# EAGLE design brd (EAGLE 6.5.0)
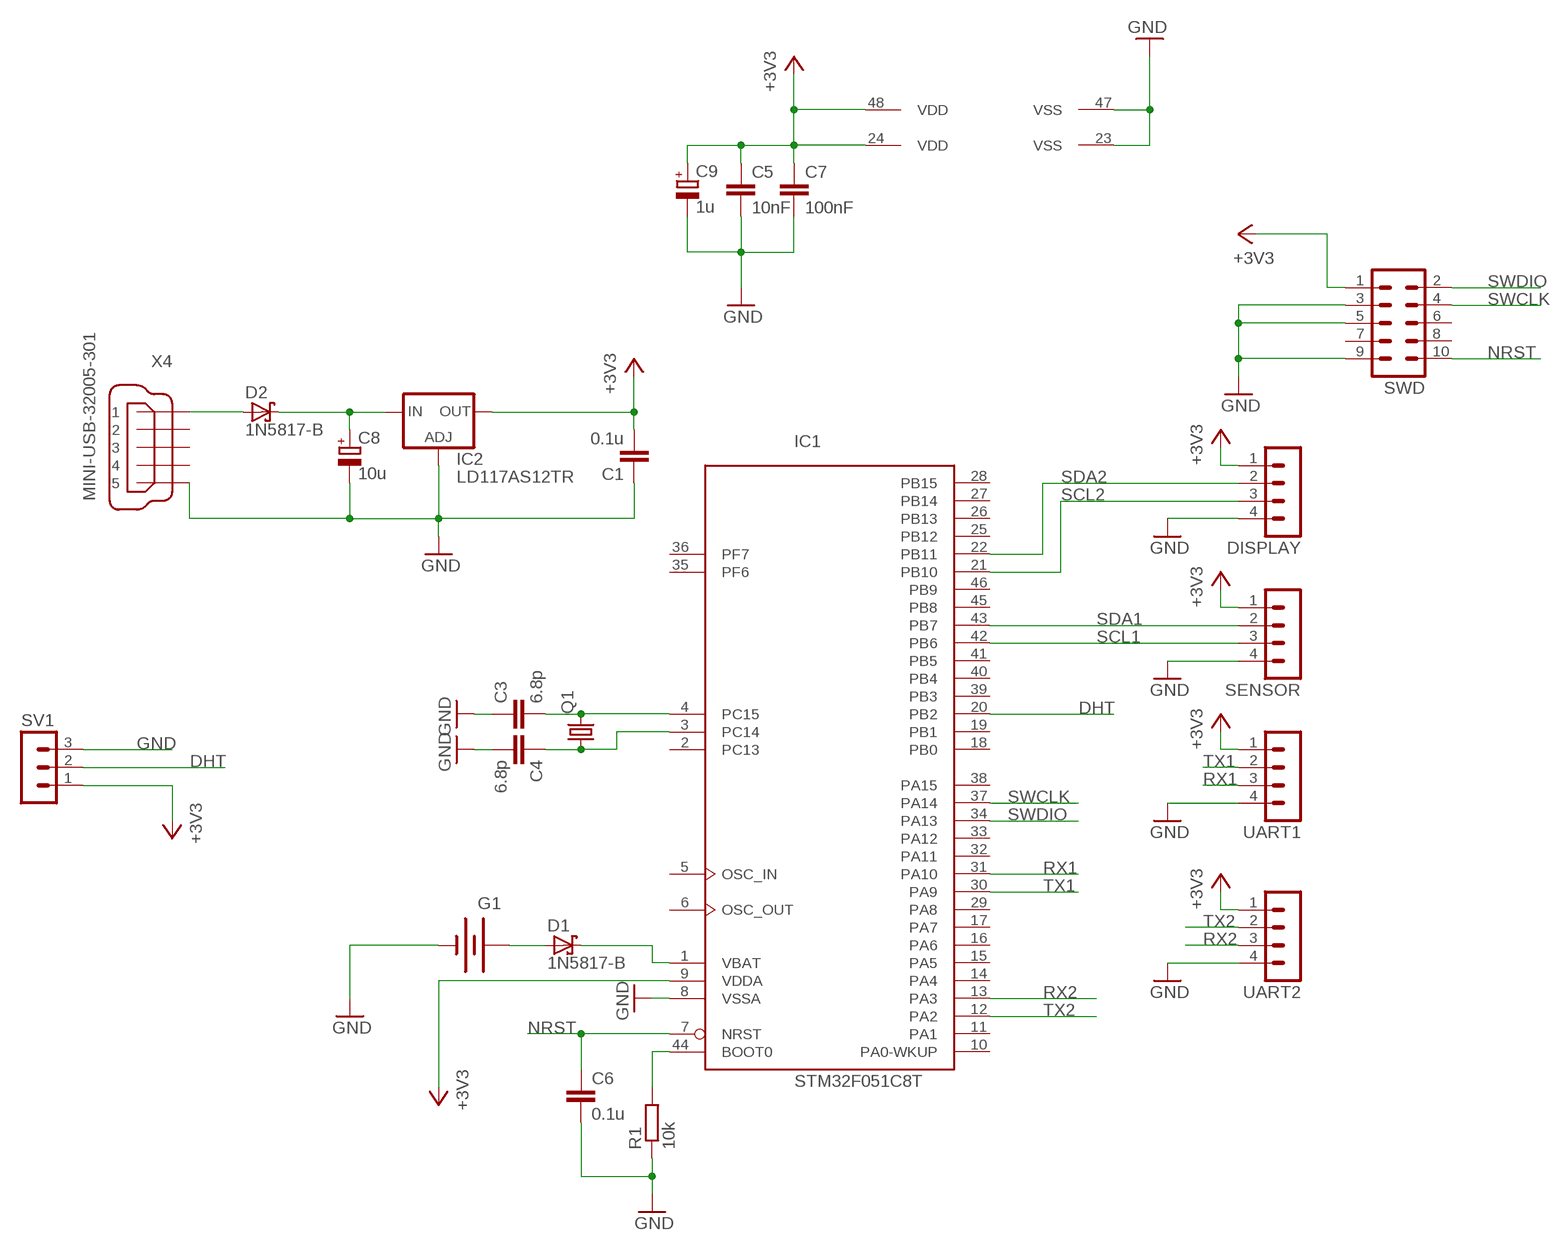
[diagram p0: schematic, sheet 1]

## Parts
C1  0.1u  C-EU025-024X044  [C025-024X044]
C3  6.8p  C-EUC0805  [C0805]
C4  6.8p  C-EUC0805  [C0805]
C5  10nF  C-EUC0805  [C0805]
C6  0.1u  C-EUC0805  [C0805]
C7  100nF  C-EUC0805  [C0805]
C8  10u  CPOL-EUE2,5-6E  [E2,5-6E]
C9  1u  CPOL-EUE2,5-6E  [E2,5-6E]
D1  1N5817-B  [DO41-7.6]
D2  1N5817-B  [DO41-7.6]
DISPLAY  MA04-1  [MA04-1]
G1  BATTERY20PTH  [BATTCOM_20MM_PTH]
IC1  STM32F051C8T  [LQFP48]
IC2  LD117AS12TR  [SOT223]
Q1  CRYSTALTC26H  [TC26H]
R1  10k  R-EU_R0805  [R0805]
SENSOR  MA04-1  [MA04-1]
SV1  MA03-1  [MA03-1]
SWD  MA05-2  [MA05-2]
UART1  MA04-1  [MA04-1]
UART2  MA04-1  [MA04-1]
X4  MINI-USB-32005-301  [32005-301]

## Nets
+3V3: C1.2 C5.1 C7.1 C9.+ DISPLAY.1 IC1.9(VDDA) IC1.24(VDD) IC1.48(VDD) IC2.4(OUT) SENSOR.1 SV1.1 SWD.1 UART1.1 UART2.1
DHT: IC1.20(PB2) SV1.2
GND: C1.1 C3.1 C4.2 C5.2 C6.2 C7.2 C8.- C9.- DISPLAY.4 G1.2(-) IC1.8(VSSA) IC1.23(VSS) IC1.47(VSS) IC2.1(ADJ) R1.1 SENSOR.4 SV1.3 SWD.3 SWD.5 SWD.9 UART1.4 UART2.4 X4.5
N$1: C8.+ D2.C IC2.3(IN)
N$2: C3.2 IC1.4(PC15) Q1.2
N$3: IC1.44(BOOT0) R1.2
N$4: C4.1 IC1.3(PC14) Q1.1
N$6: D2.A X4.1
N$7: D1.C IC1.1(VBAT)
N$8: D1.A G1.1(+)
NRST: C6.1 IC1.7(NRST) SWD.10
RX1: IC1.31(PA10) UART1.3
RX2: IC1.13(PA3) UART2.3
SCL1: IC1.42(PB6) SENSOR.3
SCL2: DISPLAY.3 IC1.21(PB10)
SDA1: IC1.43(PB7) SENSOR.2
SDA2: DISPLAY.2 IC1.22(PB11)
SWCLK: IC1.37(PA14) SWD.4
SWDIO: IC1.34(PA13) SWD.2
TX1: IC1.30(PA9) UART1.2
TX2: IC1.12(PA2) UART2.2
Unconnected: IC1.2(PC13) IC1.5(OSC_IN) IC1.6(OSC_OUT) IC1.10(PA0-WKUP) IC1.11(PA1) IC1.14(PA4) IC1.15(PA5) IC1.16(PA6) IC1.17(PA7) IC1.18(PB0) IC1.19(PB1) IC1.25(PB12) IC1.26(PB13) IC1.27(PB14) IC1.28(PB15) IC1.29(PA8) IC1.32(PA11) IC1.33(PA12) IC1.35(PF6) IC1.36(PF7) IC1.38(PA15) IC1.39(PB3) IC1.40(PB4) IC1.41(PB5) IC1.45(PB8) IC1.46(PB9) SWD.6 SWD.7 SWD.8 X4.2 X4.3 X4.4

## Library data of the parts
C1 C3-C7 = rcl:C-EU: CAPACITOR, European symbol
C8 C9 = rcl:CPOL-EU: POLARIZED CAPACITOR, European symbol
D1 D2 = diode:1N581*: 1.0A SCHOTTKY BARRIER RECTIFIER Source: http://www.diodes.com/datasheets/ds23001.pdf
DISPLAY SENSOR UART1 UART2 = con-lstb:MA04-1: PIN HEADER; OC_FARNELL: unknown; OC_NEWARK: unknown
G1 = SparkFun-Electromechanical:BATTERY: Battery Holders Various common sizes : AA, AAA, 18650 (PRT-12895), 20mm coin cell and 12mm coin cell. 20MM_4LEGS, BATT-10373
IC1 = micro-stm_v2:STM32F051C*T: ARM 32-bit Cortex™-M0 CPU 48 MHz maximum frequency 16 to 64 Kbytes of Flash memory 4 to 8 kbytes of SRAM 39 GPIOs 2.0 to 3.6 V application supply
IC2 = v-reg:LD117A?*: Low drop fixed and adjustable positive voltage regulators 1 A Source: http://www.st.com/stonline/products/literature/ds/7194/ld1117axx.pdf
Q1 = crystal:CRYSTAL: CRYSTAL; OC_FARNELL: unknown; OC_NEWARK: unknown
R1 = rcl:R-EU_: RESISTOR, European symbol
SV1 = con-lstb:MA03-1: PIN HEADER; OC_FARNELL: unknown; OC_NEWARK: unknown
SWD = con-lstb:MA05-2: PIN HEADER; OC_FARNELL: unknown; OC_NEWARK: unknown
X4 = con-cypressindustries:MINI-USB-: MINI USB-B Conector Source: www.cypressindustries.com; OC_FARNELL: unknown; OC_NEWARK: unknown

## Board
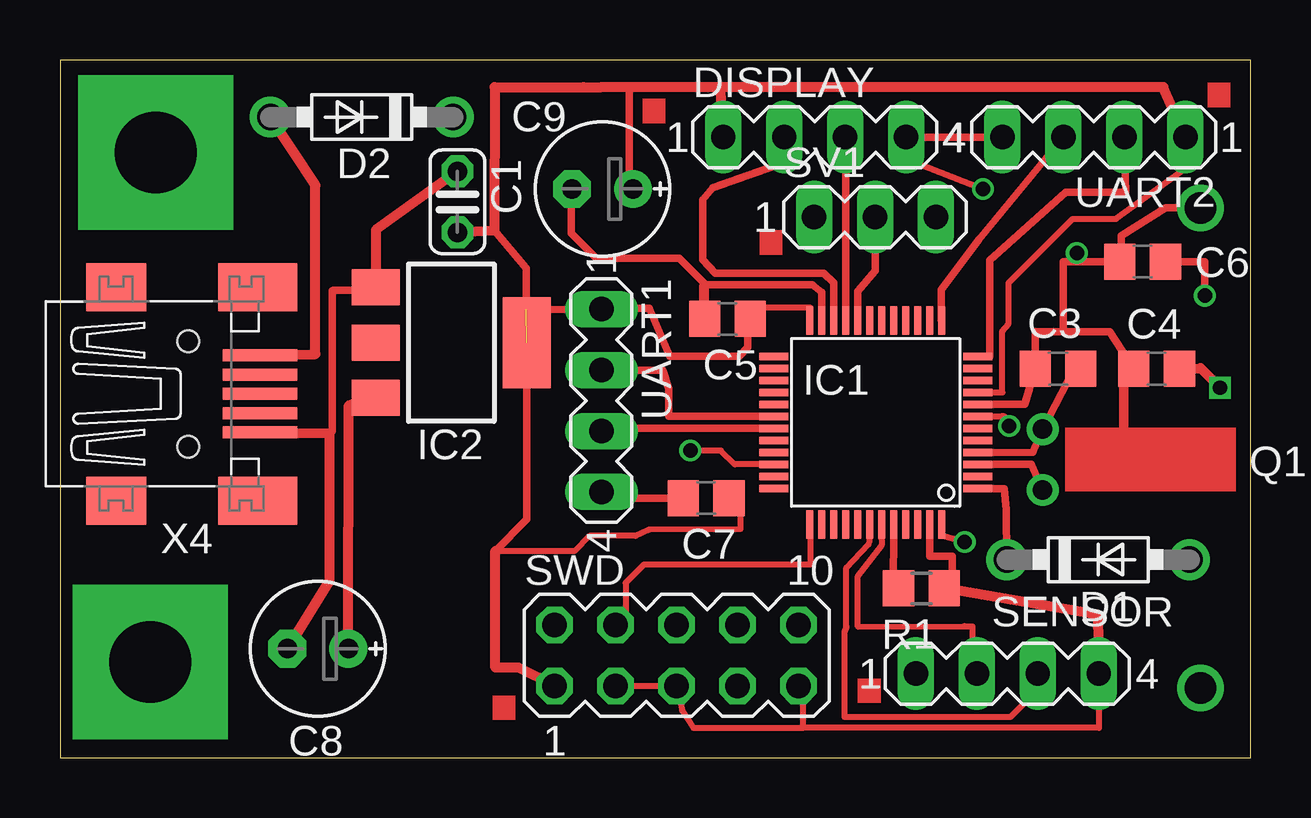
[diagram p1: board, top side]
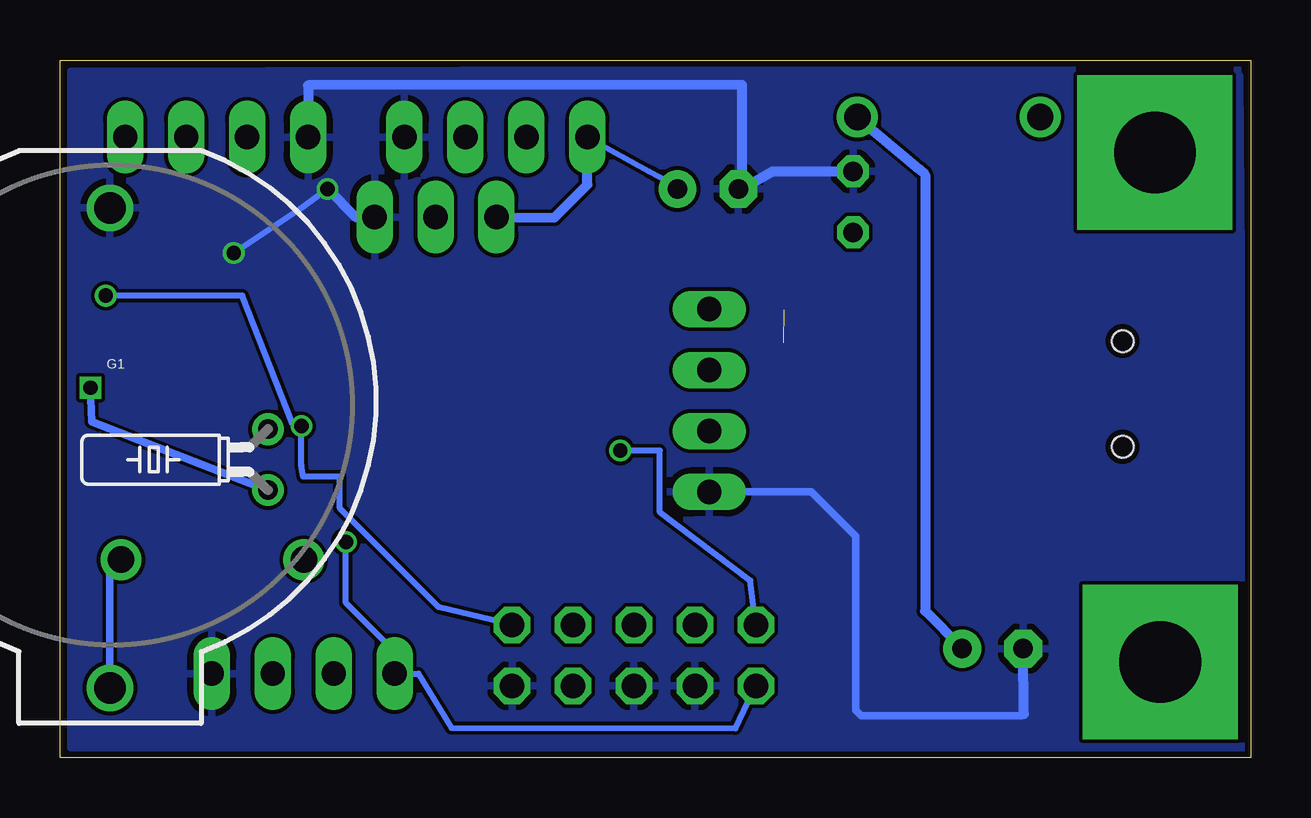
[diagram p2: board, bottom side, seen from below]

Size 49.61 x 29.07 mm. Coordinates in mm from the lower left corner, seen from the top.
Outline: 0,0 49.61,0 49.61,29.07 0,29.07 0,0
Copper layers (1*16): Top 0.035mm / dielectric 1.5mm / Bottom 0.035mm
Design rules "SeeedStudio_2layer_DRU_no_angle_20140221": minimum track width 6mil, minimum drill 12mil, track to track 6mil, track to pad 6mil, pad to pad 6mil, via to via 6mil, smd to smd 0mil, copper to edge 10mil, drill to drill 10mil, minimum pad ring 10mil, minimum via ring 6mil, stop-mask expansion 2mil, vias tented up to drill 100mil, thermal gap 10mil

### Footprints (pad centres in the part's own frame; a part is rotated, then mirrored left to right if it is on the bottom)
C025-024X044 = drill 0.813 octagon: 1 -1.27,0; 2 1.27,0
C0805 = smd 1.3 x 1.5: 1 -0.95,0; 2 0.95,0
E2,5-6E = drill 0.813 pad 1.575: + -1.27,0 | drill 0.813 pad 1.575 octagon: - 1.27,0
DO41-7.6 = drill 1.1 pad 1.7: A 3.81,0; C -3.81,0
MA04-1 = drill 1.016 long: 1 -3.81,0; 2 -1.27,0; 3 1.27,0; 4 3.81,0
BATTCOM_20MM_PTH = drill 1.3: 1 11.85,0; 2 -8.15,0
LQFP48 = smd 0.3 x 1.2: 1 -2.75,-4.25; 2 -2.25,-4.25; 3 -1.75,-4.25; 4 -1.25,-4.25; 5 -0.75,-4.25; 6 -0.25,-4.25; 7 0.25,-4.25; 8 0.75,-4.25; 9 1.25,-4.25; 10 1.75,-4.25; 11 2.25,-4.25; 12 2.75,-4.25; 25 2.75,4.25; 26 2.25,4.25; 27 1.75,4.25; 28 1.25,4.25; 29 0.75,4.25; 30 0.25,4.25; 31 -0.25,4.25; 32 -0.75,4.25; 33 -1.25,4.25; 34 -1.75,4.25; 35 -2.25,4.25; 36 -2.75,4.25 | smd 1.2 x 0.3: 13 4.25,-2.75; 14 4.25,-2.25; 15 4.25,-1.75; 16 4.25,-1.25; 17 4.25,-0.75; 18 4.25,-0.25; 19 4.25,0.25; 20 4.25,0.75; 21 4.25,1.25; 22 4.25,1.75; 23 4.25,2.25; 24 4.25,2.75; 37 -4.25,2.75; 38 -4.25,2.25; 39 -4.25,1.75; 40 -4.25,1.25; 41 -4.25,0.75; 42 -4.25,0.25; 43 -4.25,-0.25; 44 -4.25,-0.75; 45 -4.25,-1.25; 46 -4.25,-1.75; 47 -4.25,-2.25; 48 -4.25,-2.75
SOT223 = smd 1.5 x 2: 1 -2.3,-3.15; 2 0,-3.15; 3 2.3,-3.15 | smd 3.8 x 2: 4 0,3.15
TC26H = drill 0.813: 1 -1.27,0; 2 1.27,0
R0805 = smd 1.3 x 1.5: 1 -0.95,0; 2 0.95,0
MA03-1 = drill 1.016 long: 1 -2.54,0; 2 0,0; 3 2.54,0
MA05-2 = drill 1.016 octagon: 1 -5.08,-1.27; 2 -5.08,1.27; 3 -2.54,-1.27; 4 -2.54,1.27; 5 0,-1.27; 6 0,1.27; 7 2.54,-1.27; 8 2.54,1.27; 9 5.08,-1.27; 10 5.08,1.27
32005-301 = smd 3.1 x 0.5: 1 3,1.6; 2 3,0.8; 3 3,0; 4 3,-0.8; 5 3,-1.6 | smd 2.5 x 2: M1 -3,-4.45; M2 -3,4.45 | smd 3.3 x 2: M3 2.9,4.45; M4 2.9,-4.45 | hole 0.9: 0,2.2; 0,-2.2

### Placement (x,y rotation side)
C1  16.56,23.16 270 top
C3  41.58,16.21 0 top
C4  45.69,16.21 180 top
C5  27.81,18.29 180 top
C6  45.11,20.68 180 top
C7  26.92,10.82 180 top
C8  10.74,4.55 180 top
C9  22.61,23.7 180 top
D1  43.26,8.26 0 top
D2  12.57,26.7 180 top
DISPLAY  31.45,25.86 0 top
G1  47.52,14.76 270 bottom
IC1  33.99,13.97 90 top
IC2  16.31,17.3 270 top
Q1  40.94,12.42 90 bottom
R1  35.89,7.06 180 top
SENSOR  39.47,3.51 0 top
SV1  33.96,22.53 0 top
SWD  25.69,4.27 0 top
UART1  22.56,14.88 270 top
UART2  43.08,25.86 180 top
X4  5.33,15.16 0 top

### Tracks (layer width: path | path; a pad name or v marks a point on that pad's centre or on a via)
+3V3  (via drill 0.6 pad 0.3)  (1 unrouted)
  Top 0.254: C5.1 29.21,18.44 29.21,18.77 | 29.21,18.77 29.13,18.77 | 29.21,18.77 31.24,18.77 IC1.24 | IC1.48 36.73,9.26 v37.69,8.99 | C7.1 28.32,11.05 28.35,9.52 24.51,9.5 23.98,9.25 22.07,9.25 21.44,8.61 18.14,8.61 | IC1.9 39.27,15.22 39.27,17.78 39.52,18.09 39.52,19.79 42.19,22.45 43.99,22.45 46.84,24.51 UART2.1
  Top 0.305: UART1.1 19.43,18.66 19.43,20.4 18.08,21.97 | C9.+ 23.72,23.7 23.72,27.94 | 31.23,18.38 IC1.24 | 22.76,18.72 24.56,18.72 25.4,16.74 28.3,16.74 28.66,17.11 28.66,18.29 C5.1 | 18.14,8.61 19.46,9.93 IC2.4
  Top 0.406: C1.2 18.08,21.97 18.11,27.94 21.82,27.94 22.55,27.94 23.72,27.94 27.53,27.94 | 27.53,27.94 45.97,27.94 UART2.1 | DISPLAY.1 27.58,25.88 27.53,27.94 | SWD.1 19.1,3.76 18.14,3.76 18.14,8.61 | 22.76,18.72 UART1.1
  Bottom 0.254: SWD.1 20.68,3.04 20.95,2.34 21.46,1.22 33.3,1.24 34.67,3.51 SENSOR.1 35.66,4.42 37.69,6.45 v37.69,8.99 | DISPLAY.1 25.07,24.43 23.72,23.72 23.85,23.72
  Bottom 0.406: SV1.1 29.01,22.5 27.63,23.88 DISPLAY.1
DHT
  Top 0.305: SV1.2 33.96,20.29 33.23,19.44 IC1.20
GND  (via drill 0.6 pad 0.3)
  Top 0.254: 26.85,19.68 26.9,19.71 26.96,19.72 | 40.23,16.29 C3.1 | SENSOR.4 43.28,1.24 30.96,1.24 | 30.96,1.24 30.96,3.39 SWD.9 | 30.96,1.24 26.39,1.24 25.92,1.97 SWD.5 SWD.3 | DISPLAY.4 35.23,25.96 35.23,24.94 35.31,24.94 v38.46,23.7
  Top 0.305: R1.1 37.19,7.14 37.19,8.4 36.23,8.4 IC1.47 | DISPLAY.4 UART2.4 | IC1.23 31.73,19.4 31.34,19.71 26.9,19.71 25.81,20.8 22.35,20.8 21.31,21.84 21.31,23.7 C9.- | C4.2 43.74,17.76 41.81,17.76 | IC1.8 40.2,14.72 C3.1 40.63,17.76 41.81,17.76 | 42.37,20.68 C6.2 44.22,20.74 44.22,21.74 46.07,22.91 G1.2 | 42.37,20.68 v42.37,21.03 | 42.37,20.68 41.81,20.68 41.81,17.76 | UART1.4 22.81,10.82 C7.2 | IC2.1 13.04,19.48 11.38,19.48 11.35,19.46 11.35,13.61 11.23,13.49
  Top 0.406: X4.5 11.23,13.51 11.23,13.49 11.23,7.37 C8.- | C1.1 13.16,22 IC2.1 | C5.2 26.85,18.44 26.85,19.68 | SENSOR.4 43.24,5.96 36.85,7.05 R1.1
  Bottom 0.254: v38.46,23.7 39.7,22.78 v42.37,21.03
  Bottom 0.305: 9.45,1.83 9.52,1.75 16.23,1.75 16.46,1.98 16.46,9.22 18.31,11.07 UART1.4
  Bottom 0.406: UART2.4 39.27,28.02 21.18,28.04 21.18,23.7 | C9.- 21.18,23.7 | 21.18,23.7 19.91,24.43 C1.1 | 9.45,1.83 C8.- | SV1.3 37.26,22.5 v38.46,23.7
  pour Bottom: 0.48,28.73 49.15,28.6 49.15,0.41 0.23,0.25 0.46,28.42 0.64,28.22 0.64,28.24
M3_HOLE  (via drill 3.4 pad 6.45)
  other vias: 3.99,25.22
N$1
  Top 0.406: C8.+ 12.04,14.68 IC2.3
  Bottom 0.406: D2.C 13.82,24.54 13.56,24.28 13.56,6.12 12.01,4.57 C8.+
N$2
  Top 0.305: IC1.4 38.23,12.7 40.54,12.73 Q1.2 42,15.68 C3.2
N$3
  Top 0.305: IC1.44 34.72,6.9 R1.2
N$4  (via drill 0.6)
  Top 0.305: IC1.3 40.46,12.22 Q1.1
  Top 0.406: C4.1 47.52,16.23 v48.34,15.42
  Bottom 0.305: v48.34,15.42 48.29,13.99 Q1.1
N$5  (via drill 3.4 pad 6.45)
  other vias: 3.76,3.99
N$6
  Top 0.406: X4.1 10.64,16.82 10.64,23.85 D2.A
N$7
  Top 0.305: D1.C 39.42,10.34 39.34,11.2 38.23,11.2 IC1.1
N$8
  Bottom 0.305: G1.1 47.52,7.8 D1.A
NRST  (via drill 0.6 pad 0.3)
  Top 0.254: IC1.7 39.34,14.22 39.22,14.22 39.34,14.22 v39.55,13.82
  Top 0.305: C6.1 47.7,20.68 v47.7,19.25
  Bottom 0.254: SWD.10 33.83,6.27 37.95,10.39 37.95,11.71 39.47,11.71 39.55,12.19 v39.55,13.82 39.9,13.89 42.01,19.25 v47.7,19.25
RX1
  Top 0.305: IC1.31 21.69,13.72 UART1.3
RX2
  Top 0.305: UART2.3 38.28,21.59 36.73,19.51 IC1.13
SCL1
  Top 0.254: SENSOR.3 40.74,2.83 39.6,1.69 32.68,1.69 32.68,5.23 32.77,5.46 32.77,7.92 33.68,8.89 33.73,9.02 IC1.42
SCL2
  Top 0.305: IC1.21 32.73,25.86 DISPLAY.3
SDA1
  Top 0.254: IC1.43 34.23,9.69 34.25,8.88 33.25,7.57 33.25,5.46 37.69,5.49 38.01,5.47 38.01,3.7 SENSOR.2
SDA2
  Top 0.305: DISPLAY.2 30.15,24.79 27.2,23.75 26.77,23.24 26.77,20.75 27.3,20.19 31.83,20.19 32.23,19.79 IC1.22
SWCLK
  Top 0.254: IC1.37 31.27,9.72 31.27,8.05 24.33,8.05 23.57,7.29 23.57,5.96 SWD.4
SWDIO  (via drill 0.6 pad 0.3)
  Top 0.254: IC1.34 28.11,12.22 27.53,12.8 v26.26,12.8
  Bottom 0.254: SWD.2 20.84,7.38 24.61,10.24 24.61,12.8 v26.26,12.8
TX1
  Top 0.305: IC1.30 25.37,14.22 25.37,15.37 25.12,16.15 UART1.2
TX2
  Top 0.305: UART2.2 44.37,24.79 44.4,23.57 41.91,23.57 38.73,20.73 38.74,16.71 IC1.12
(copper drawn outside any net)
  shapes: Top area x7